# EAGLE design MesschieberV2 (EAGLE 6.4)

## Sheet 1 of 4
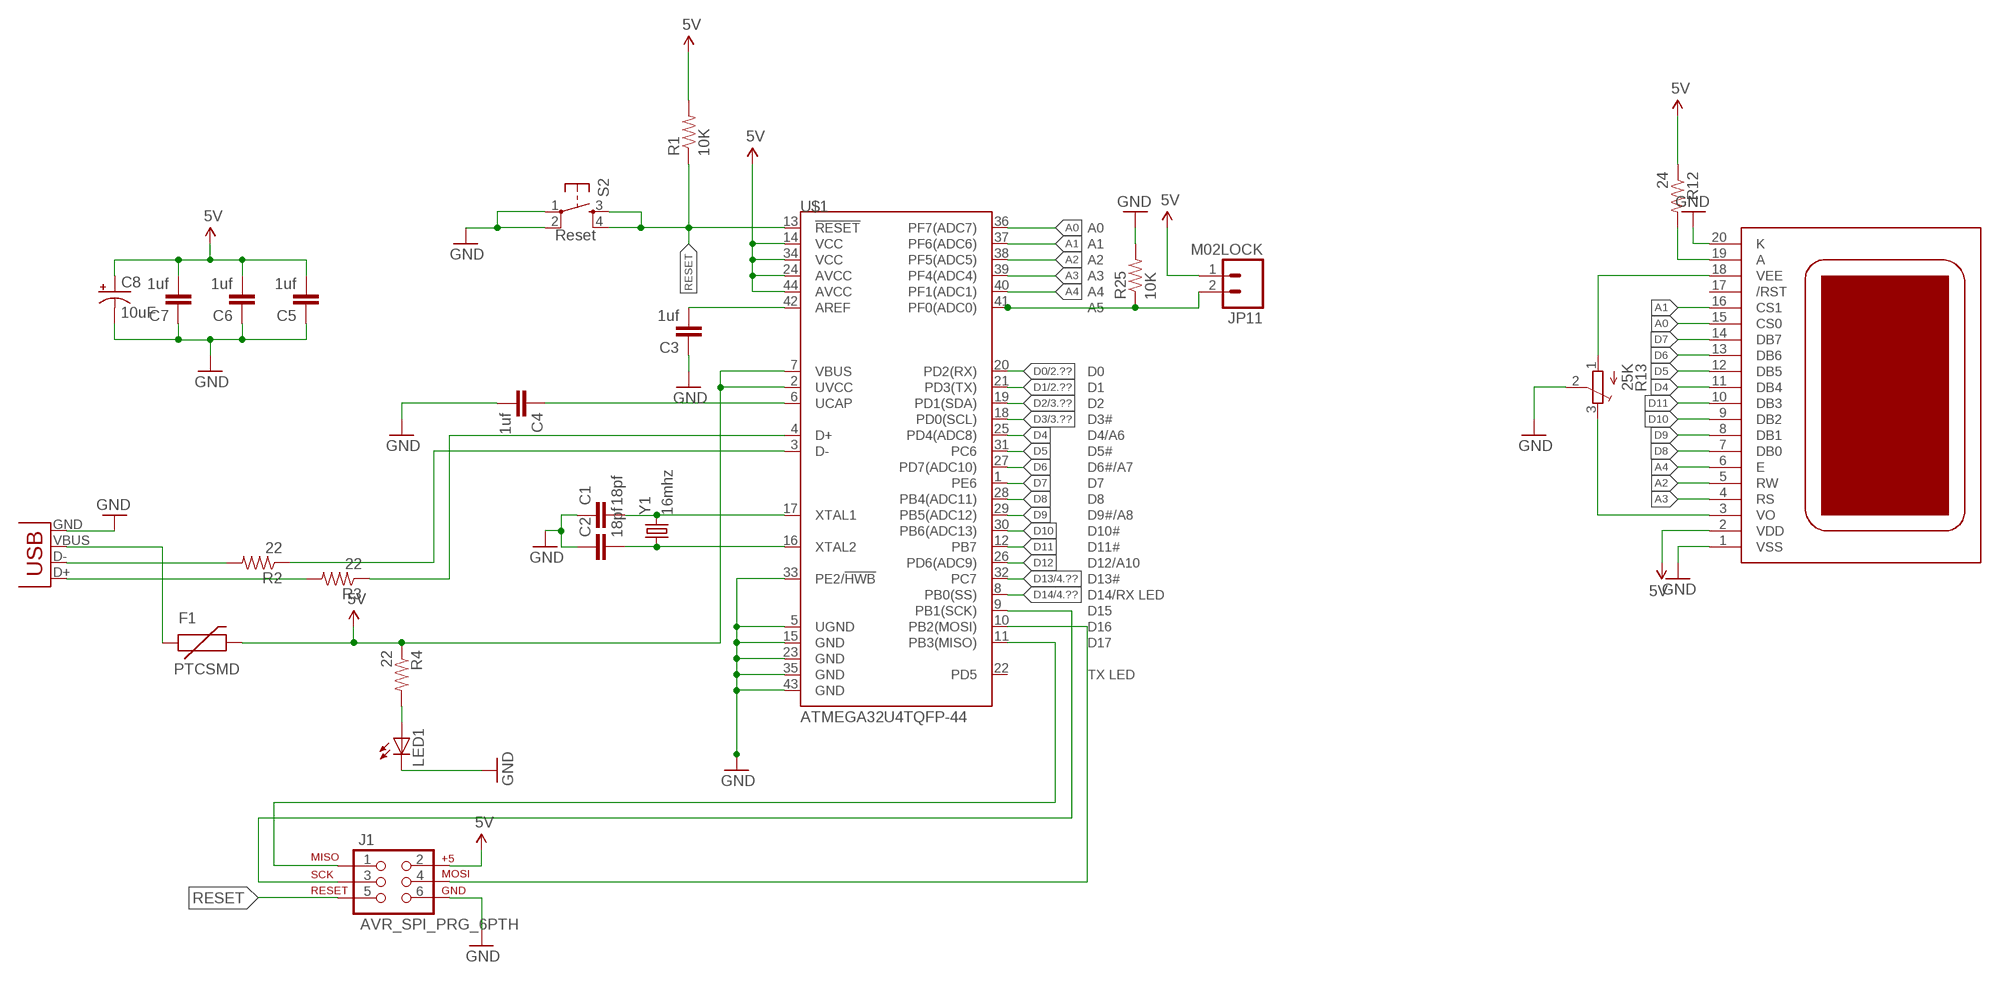
[diagram p0: schematic, sheet 1]

### Parts
C1  18pf  CAP0805  [0805]
C2  18pf  CAP0805  [0805]
C3  1uf  CAP0805  [0805]
C4  1uf  CAP0805  [0805]
C5  1uf  CAP0805  [0805]
C6  1uf  CAP0805  [0805]
C7  1uf  CAP0805  [0805]
C8  10uF  10UF-20V-10%(TANT)  [EIA3528]
F1  PTCSMD  [PTC-1206]
J1  AVR_SPI_PRG_6PTH  [2X3]
JP7  USB-SMD-NS  [USB-MINIB-NOSTOP]
JP11  M02LOCK  [1X02_LOCK]
LED1  LEDSML0805  [SML0805]
R1  10K  RESISTOR  [0805]
R2  22  RESISTOR  [0805]
R3  22  RESISTOR  [0805]
R4  22  RESISTOR  [0805]
R12  24  RESISTOR  [0805]
R13  25K  TRIM_EU-SM-42/43A  [SM-42/43A]
R25  10K  RESISTOR  [0805]
S2  Reset  TAC_SWITCHSND  [TACTILE_SWITCH_SMD]
U$1  ATMEGA32U4TQFP-44  [TQFP44]
U$2  TS12864A  [TS12864]
Y1  16mhz  CRYSTAL5X3  [CRYSTAL-SMD-5X3]

### Nets
5V: C5.2 C6.2 C7.2 C8.A(+) F1.2 J1.2 JP11.1 R1.2 R4.1 R12.1 U$1.2(UVCC) U$1.7(VBUS) U$1.14(VCC) U$1.24(AVCC) U$1.34(VCC) U$1.44(AVCC) U$2.2(VDD) ; also sheet 2,3,4
A: R12.2 U$2.19(A)
A0: U$1.36(PF7(ADC7)) U$2.15(CS0)
A1: U$1.37(PF6(ADC6)) U$2.16(CS1)
A2: U$1.38(PF5(ADC5)) U$2.5(RW)
A3: U$1.39(PF4(ADC4)) U$2.4(RS)
A4: U$1.40(PF1(ADC1)) U$2.6(E)
D0: U$1.20(PD2(RX)) ; also sheet 2
D1: U$1.21(PD3(TX)) ; also sheet 2
D2: U$1.19(PD1(SDA)) ; also sheet 3
D3: U$1.18(PD0(SCL)) ; also sheet 3
D4: U$1.25(PD4(ADC8)) U$2.11(DB4)
D5: U$1.31(PC6) U$2.12(DB5)
D6: U$1.27(PD7(ADC10)) U$2.13(DB6)
D7: U$1.1(PE6) U$2.14(DB7)
D8: U$1.28(PB4(ADC11)) U$2.7(DB0)
D9: U$1.29(PB5(ADC12)) U$2.8(DB1)
D10: U$1.30(PB6(ADC13)) U$2.9(DB2)
D11: U$1.12(PB7) U$2.10(DB3)
D12: U$1.26(PD6(ADC9))
D13: U$1.32(PC7) ; also sheet 4
D14: U$1.8(PB0(SS)) ; also sheet 4
GND: C1.1 C2.1 C3.1 C4.2 C5.1 C6.1 C7.1 C8.C(-) J1.6 JP7.GND LED1.C R13.2(S) R25.2 S2.1 S2.2 U$1.5(UGND) U$1.15(GND) U$1.23(GND) U$1.33(PE2/!HWB) U$1.35(GND) U$1.43(GND) U$2.1(VSS) U$2.20(K) ; also sheet 2,3,4
N$1: C3.2 U$1.42(AREF)
N$2: C2.2 U$1.16(XTAL2) Y1.1
N$3: C1.2 U$1.17(XTAL1) Y1.3
N$5: JP7.D- R2.2
N$6: JP7.D+ R3.2
N$7: R3.1 U$1.4(D+)
N$8: R2.1 U$1.3(D-)
N$9: F1.1 JP7.VBUS
N$10: LED1.A R4.2
N$11: J1.3 U$1.9(PB1(SCK))
N$12: J1.1 U$1.11(PB3(MISO))
N$13: J1.4 U$1.10(PB2(MOSI))
N$14: C4.1 U$1.6(UCAP)
N$29: JP11.2 R25.1 U$1.41(PF0(ADC0))
N$38: R13.3(E) U$2.3(VO)
RESET: J1.5 R1.1 S2.3 S2.4 U$1.13(!RESET)
VEE: R13.1(A) U$2.18(VEE)
Unconnected: U$1.22(PD5) U$2.17(/RST)

## Sheet 2 of 4
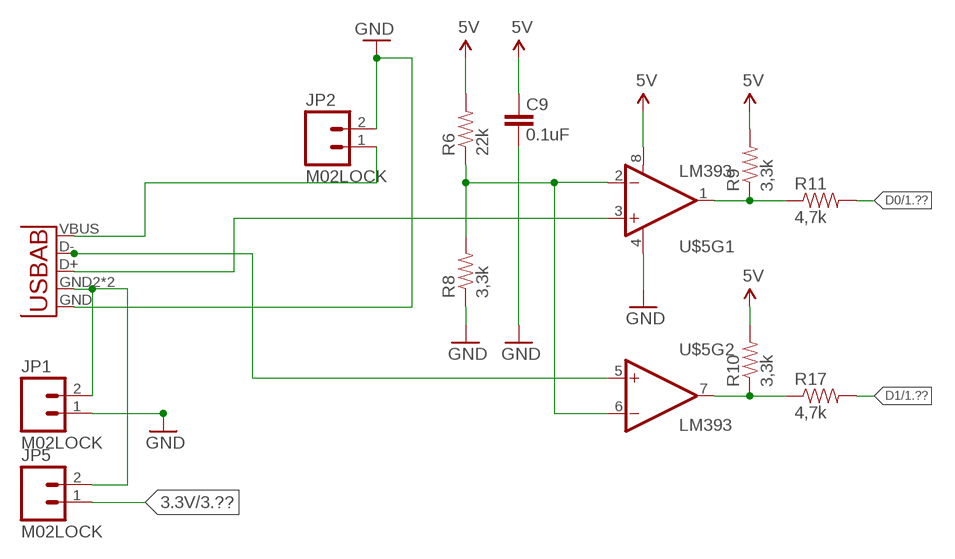
[diagram p1: schematic, sheet 2]

### Parts
C9  0.1uF  CAP0805  [0805]
JP1  M02LOCK  [1X02_LOCK]
JP2  M02LOCK  [1X02_LOCK]
JP5  M02LOCK  [1X02_LOCK]
R6  22k  RESISTOR  [0805]
R8  3,3k  RESISTOR  [0805]
R9  3,3k  RESISTOR  [0805]
R10  3,3k  RESISTOR  [0805]
R11  4,7k  RESISTOR  [0805]
R17  4,7k  RESISTOR  [0805]
U$5  LM393  [SO08]
U$7  USB-A  [USB-A]

### Nets
3.3V: JP5.1 ; also sheet 3,4
5V: C9.2 R6.2 R9.2 R10.2 U$5.8(V+) ; also sheet 1,3,4
D0: R11.2 ; also sheet 1
D1: R17.2 ; also sheet 1
DATA1: R9.1 R11.1 U$5.1(OUT)
GND: C9.1 JP1.1 JP2.2 R8.1 U$5.4(V-) U$7.GND ; also sheet 1,3,4
N$4: R6.1 R8.2 U$5.2(-IN) U$5.6(-IN)
N$16: U$5.3(+IN) U$7.D+
N$17: U$5.5(+IN) U$7.D-
N$18: JP2.1 U$7.VBUS
N$19: JP1.2 JP5.2 U$7.GND2(USBID) U$7.GND3(USBID)
SCK1: R10.1 R17.1 U$5.7(OUT)

## Sheet 3 of 4
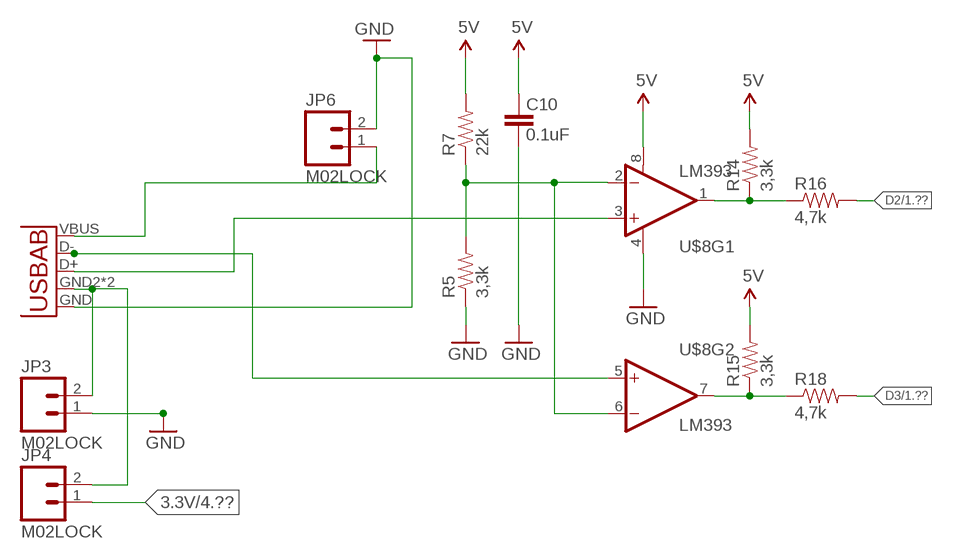
[diagram p2: schematic, sheet 3]

### Parts
C10  0.1uF  CAP0805  [0805]
JP3  M02LOCK  [1X02_LOCK]
JP4  M02LOCK  [1X02_LOCK]
JP6  M02LOCK  [1X02_LOCK]
R5  3,3k  RESISTOR  [0805]
R7  22k  RESISTOR  [0805]
R14  3,3k  RESISTOR  [0805]
R15  3,3k  RESISTOR  [0805]
R16  4,7k  RESISTOR  [0805]
R18  4,7k  RESISTOR  [0805]
U$8  LM393  [SO08]
U$9  USB-A  [USB-A]

### Nets
3.3V: JP4.1 ; also sheet 2,4
5V: C10.2 R7.2 R14.2 R15.2 U$8.8(V+) ; also sheet 1,2,4
D2: R16.2 ; also sheet 1
D3: R18.2 ; also sheet 1
DATA2: R14.1 R16.1 U$8.1(OUT)
GND: C10.1 JP3.1 JP6.2 R5.1 U$8.4(V-) U$9.GND ; also sheet 1,2,4
N$15: R5.2 R7.1 U$8.2(-IN) U$8.6(-IN)
N$20: U$8.3(+IN) U$9.D+
N$21: U$8.5(+IN) U$9.D-
N$22: JP6.1 U$9.VBUS
N$23: JP3.2 JP4.2 U$9.GND2(USBID) U$9.GND3(USBID)
SCK2: R15.1 R18.1 U$8.7(OUT)

## Sheet 4 of 4
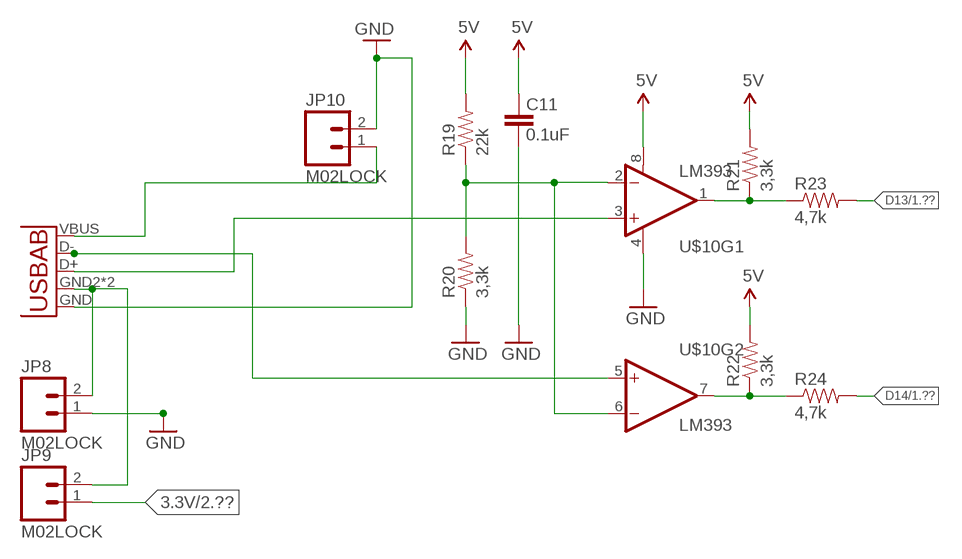
[diagram p3: schematic, sheet 4]

### Parts
C11  0.1uF  CAP0805  [0805]
JP8  M02LOCK  [1X02_LOCK]
JP9  M02LOCK  [1X02_LOCK]
JP10  M02LOCK  [1X02_LOCK]
R19  22k  RESISTOR  [0805]
R20  3,3k  RESISTOR  [0805]
R21  3,3k  RESISTOR  [0805]
R22  3,3k  RESISTOR  [0805]
R23  4,7k  RESISTOR  [0805]
R24  4,7k  RESISTOR  [0805]
U$10  LM393  [SO08]
U$11  USB-A  [USB-A]

### Nets
3.3V: JP9.1 ; also sheet 2,3
5V: C11.2 R19.2 R21.2 R22.2 U$10.8(V+) ; also sheet 1,2,3
D13: R23.2 ; also sheet 1
D14: R24.2 ; also sheet 1
DATA3: R21.1 R23.1 U$10.1(OUT)
GND: C11.1 JP8.1 JP10.2 R20.1 U$10.4(V-) U$11.GND ; also sheet 1,2,3
N$24: R19.1 R20.2 U$10.2(-IN) U$10.6(-IN)
N$25: U$10.3(+IN) U$11.D+
N$26: U$10.5(+IN) U$11.D-
N$27: JP10.1 U$11.VBUS
N$28: JP8.2 JP9.2 U$11.GND2(USBID) U$11.GND3(USBID)
SCK3: R22.1 R24.1 U$10.7(OUT)

## Library data of the parts
C1-C7 = SparkFun-Capacitors:CAP: Capacitor Standard 0603 ceramic capacitor, and 0.1" leaded capacitor.
C8 = SparkFun-Capacitors:10UF-20V-10%(TANT): CAP-08063; PROD_ID: CAP-08063
C9-C11 = SparkFun:CAP: Capacitor Standard 0603 ceramic capacitor, and 0.1" leaded capacitor.
F1 = SparkFun-PowerIC:PTC: Resettable Fuse PTC Resettable Fuse. Spark Fun Electronics SKU : COM-08357; PROD_ID: RES-11150
J1 = SparkFun-Connectors:AVR_SPI_PRG_6: AVR ISP 6 Pin This is the reduced ISP connector for AVR programming. Common on Arduino. This footprint will take up less PCB space and can be used with a 10-pin to 6-pin adapter such as SKU: BOB-08508
JP1-JP6 JP8-JP11 = SparkFun-Connectors:M02: Standard 2-pin 0.1" header. Use with - straight break away headers ( PRT-00116) - right angle break away headers (PRT-00553) - swiss pins (PRT-00743) - machine pins (PRT-00117) - female headers (PRT-00115) Molex polarized connector foot print use with: PRT-08233 with associated crimp pins and housings. 2.54_SCREWTERM for use with PRT-10571. 3.5mm Screw Terminal footprints for PRT-08084 5mm Screw Terminal footprints for use with PRT-08433
JP7 = SparkFun-Connectors:USB: USB Connectors USB-B-PTH is fully proven SKU : PRT-00139/CONN-08278 USB-miniB is fully proven SKU : PRT-00587 USB-A-PCB is untested. USB-A-H is throughly reviewed, but untested. Spark Fun Electronics SKU : PRT-00437 USB-B-SMT is throughly reviewed, but untested. Needs silkscreen touching up. USB-A-S has not been used/tested USB-MB-H has not been used/tested USB-MICROB has been used. CONN-09505
LED1 = led:LED: LED OSRAM: - CHIPLED LG R971, LG N971, LY N971, LG Q971, LY Q971, LO R971, LY R971 LH N974, LH R974 LS Q976, LO Q976, LY Q976 LO Q996 - Hyper CHIPLED LW Q18S LB Q993, LB Q99A, LB R99A - SideLED LS A670, LO A670, LY A670, LG A670, LP A670 LB A673, LV A673, LT A673, LW A673 LH A674 LY A675 LS A676, LA A676, LO A676, LY A676, LW A676 LS A679, LY A679, LG A679 - Hyper Micro SIDELED® LS Y876, LA Y876, LO Y876, LY Y876 LT Y87S - SmartLED LW L88C, LW L88S LB L89C, LB L89S, LG L890 LS L89K, LO L89K, LY L89K LS L896, LA L896, LO L896, LY L896 - TOPLED LS T670, LO T670, LY T670, LG T670, LP T670 LSG T670, LSP T670, LSY T670, LOP T670, LYG T670 LG T671, LOG T671, LSG T671 LB T673, LV T673, LT T673, LW T673 LH T674 LS T676, LA T676, LO T676, LY T676, LB T676, LH T676, LSB T676, LW T676 LB T67C, LV T67C, LT T67C, LS T67K, LO T67K, LY T67K, LW E67C LS E67B, LA E67B, LO E67B, LY E67B, LB E67C, LV E67C, LT E67C LW T67C LS T679, LY T679, LG T679 LS T770, LO T770, LY T770, LG T770, LP T770 LB T773, LV T773, LT T773, LW T773 LH T774 LS E675, LA E675, LY E675, LS T675 LS T776, LA T776, LO T776, LY T776, LB T776 LHGB T686 LT T68C, LB T68C - Hyper Mini TOPLED® LB M676 - Mini TOPLED Santana® LG M470 LS M47K, LO M47K, LY M47K Source: http://www.osram.convergy.de LUXEON: - LUMILED® LXK2-PW12-R00, LXK2-PW12-S00, LXK2-PW14-U00, LXK2-PW14-V00 LXK2-PM12-R00, LXK2-PM12-S00, LXK2-PM14-U00 LXK2-PE12-Q00, LXK2-PE12-R00, LXK2-PE12-S00, LXK2-PE14-T00, LXK2-PE14-U00 LXK2-PB12-K00, LXK2-PB12-L00, LXK2-PB12-M00, LXK2-PB14-N00, LXK2-PB14-P00, LXK2-PB14-Q00 LXK2-PR12-L00, LXK2-PR12-M00, LXK2-PR14-Q00, LXK2-PR14-R00 LXK2-PD12-Q00, LXK2-PD12-R00, LXK2-PD12-S00 LXK2-PH12-R00, LXK2-PH12-S00 LXK2-PL12-P00, LXK2-PL12-Q00, LXK2-PL12-R00 Source: www.luxeon.com KINGBRIGHT: KA-3528ASYC Source: www.kingbright.com
R1-R12 R14-R25 = SparkFun:RESISTOR: Resistor Basic schematic elements and footprints for 0603, 1206, and PTH 1/10th watt (small) resistors.
R13 = pot:TRIM_EU-: POTENTIOMETER
S2 = SparkFun:TAC_SWITCH: Momentary Switch Button commonly used for reset or general input. Spark Fun Electronics SKU : COM-00097
U$1 = SparkFun-DigitalIC:ATMEGA32U4: Atmel 44-pin 8-bit Microcontroller with 32KBytes of ISP Flash and USB Controller
U$2 = adafruit:TS12864A: KS0108 based display. Some have slightly different pinouts so double check!
U$5 U$8 U$10 = SparkFun-AnalogIC:LM393: Low-voltage comparator
U$7 U$9 U$11 = andi:USB-A
Y1 = SparkFun-FreqCtrl:CRYSTAL: Various standard crystals. Proven footprints. Spark Fun Electronics SKU : COM-00534

## Net classes
0 default: width 0.203 mm, clearance 0.205 mm
1 vcc: width 0.254 mm, clearance 0.205 mm to class 0, clearance 0.205 mm

## Board
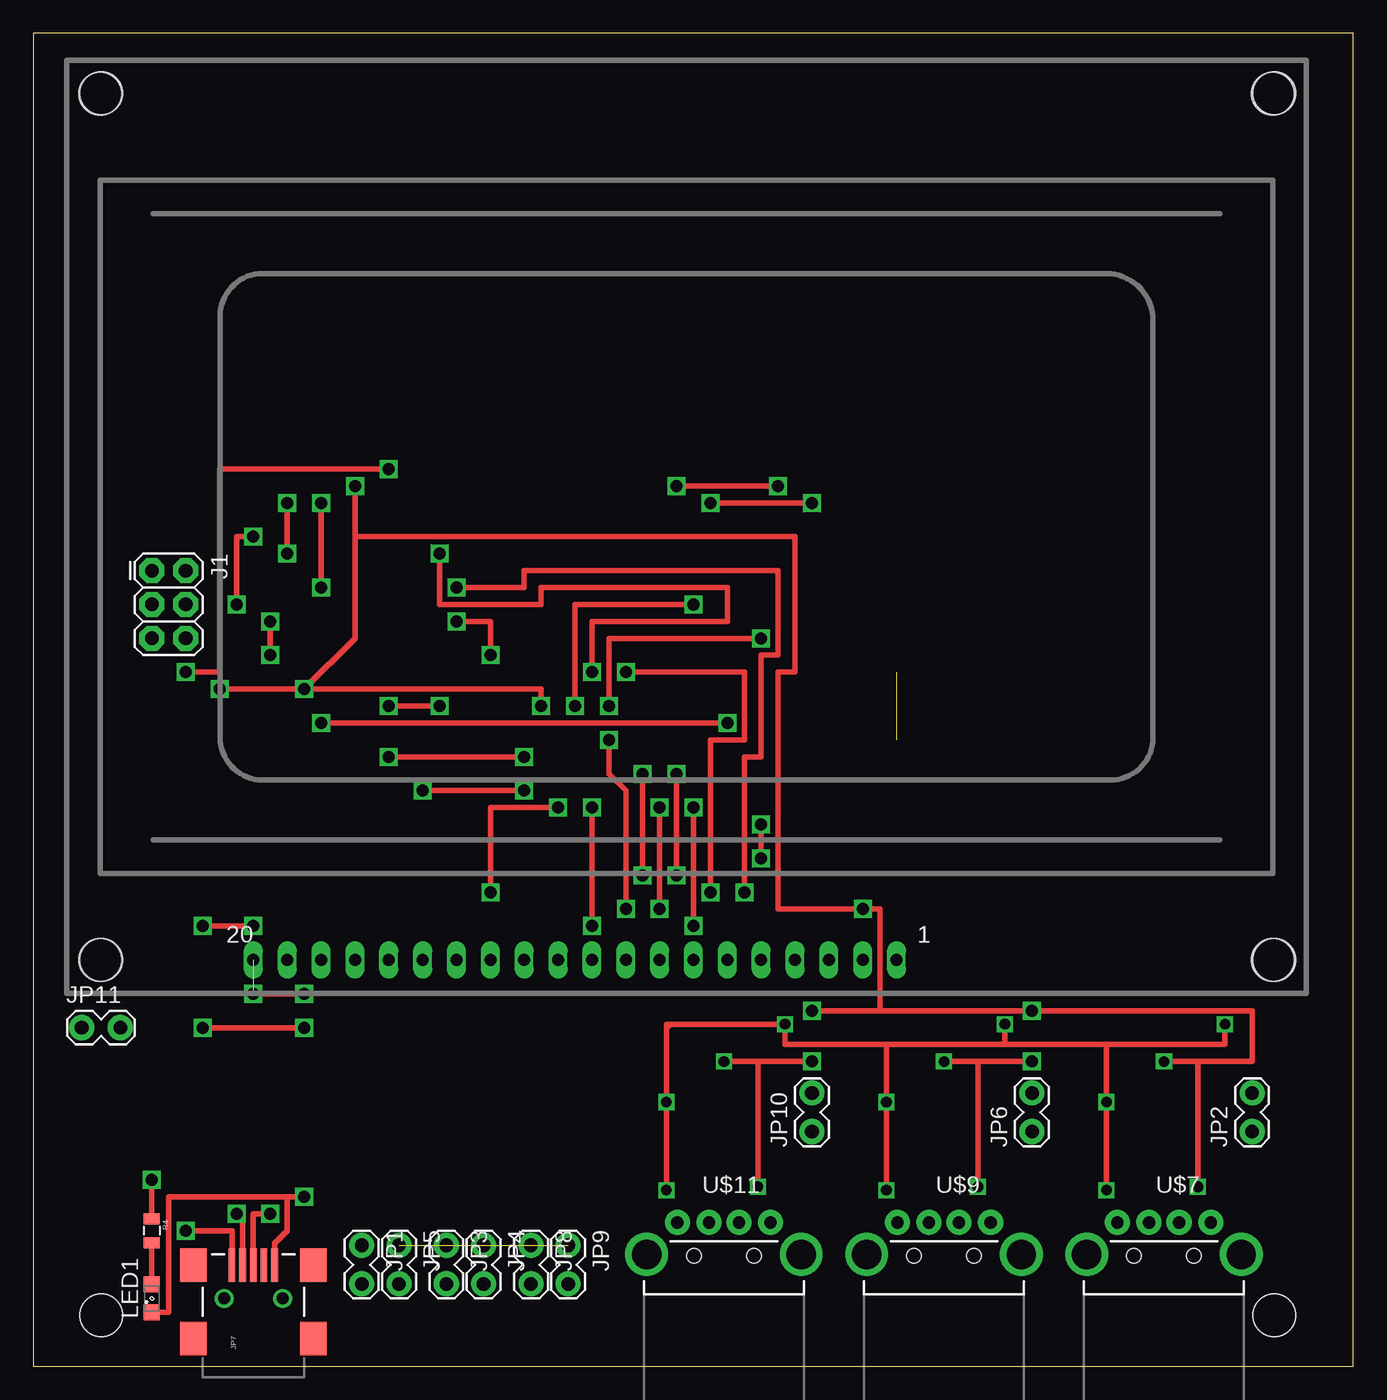
[diagram p4: board, top side]
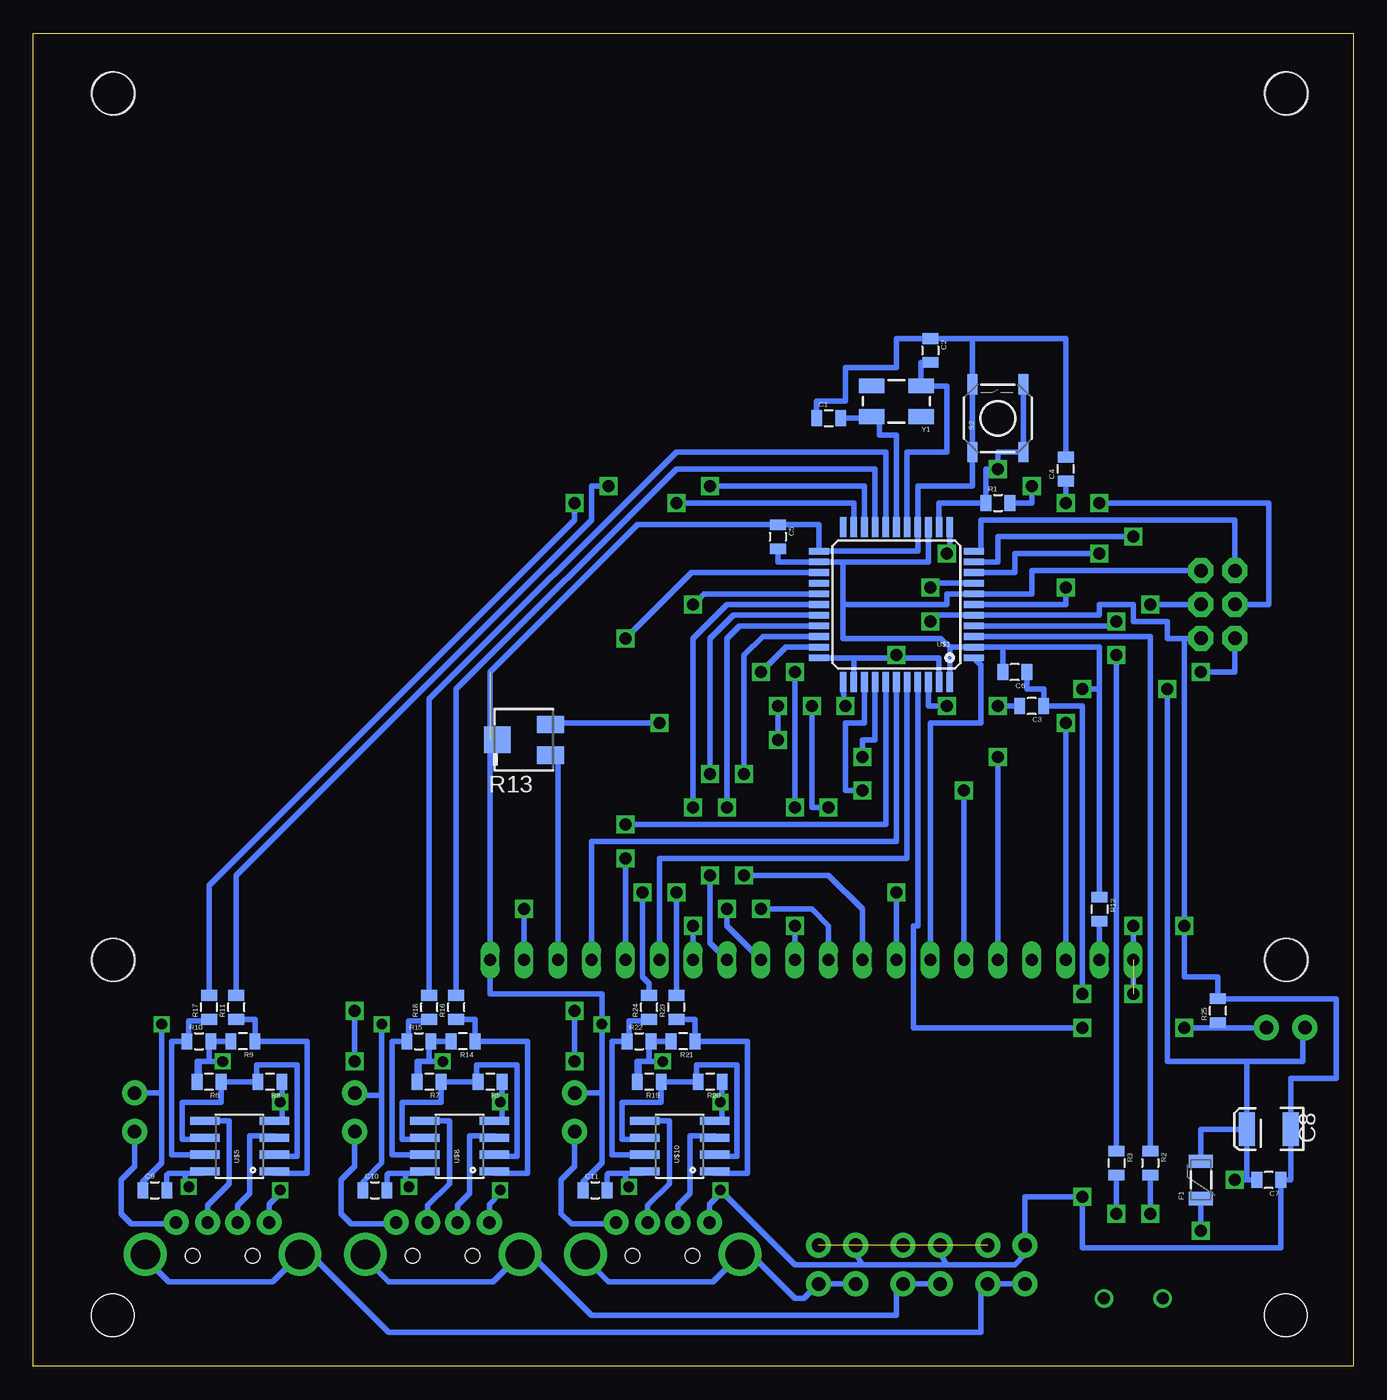
[diagram p5: board, bottom side, seen from below]

Size 99.04 x 100 mm. Coordinates in mm from the lower left corner, seen from the top.
Outline: 0,0 99.04,0 99.04,100 0,100 0,0
Copper layers (1*16): Top 0.035mm / dielectric 1.5mm / Bottom 0.035mm
Design rules "default": minimum track width 10mil, minimum drill 24mil, track to track 8mil, track to pad 8mil, pad to pad 8mil, via to via 8mil, smd to smd 8mil, copper to edge 40mil, drill to drill 8mil, minimum pad ring 10mil, minimum via ring 8mil, stop-mask expansion 4mil, vias tented up to drill 0mil, thermal gap 10mil
Holes 3.2 mm at 5.08,95.5 93.09,95.5 93.09,30.48 5.08,30.48 5.08,3.81 93.09,3.81

### Footprints (pad centres in the part's own frame; a part is rotated, then mirrored left to right if it is on the bottom)
0805 = smd 0.8 x 1.2: 1 -0.9,0; 2 0.9,0
EIA3528 = smd 1.2 x 2.5: A 1.65,0; C -1.65,0
PTC-1206 = smd 1 x 1.8: 1 -1.4,0; 2 1.4,0
2X3 = drill 1.016 pad 1.88 octagon: 1 0,0; 2 0,2.54; 3 2.54,0; 4 2.54,2.54; 5 5.08,0; 6 5.08,2.54
1X02_LOCK = drill 1.016 pad 1.88: 1 -0.178,0; 2 2.718,0
USB-MINIB-NOSTOP = smd 2.5 x 0.5: D+ 2.5,0; D- 2.5,0.8; GND 2.5,-1.6; ID 2.5,-0.8; VBUS 2.5,1.6 | smd 2.5 x 2: G1 -3,-4.5; G2 -3,4.5; G3 2.5,4.5; G4 2.5,-4.5 | drill 0.9 pad 0.8: H1 0,2.2 | drill 0.9 pad 0.787: H2 0,-2.2
SML0805 = smd 1.2 x 1.2: A 1.05,0; C -1.05,0
SM-42/43A = smd 2 x 1.3: 1 2,1.15; 3 2,-1.15 | smd 2 x 2: 2 -2,0
TACTILE_SWITCH_SMD = smd 1.524 x 0.762: 1 -2.54,1.905; 2 2.54,1.905; 3 -2.54,-1.905; 4 2.54,-1.905
TQFP44 = smd 1.5 x 0.5: 1 -5.8,4; 2 -5.8,3.2; 3 -5.8,2.4; 4 -5.8,1.6; 5 -5.8,0.8; 6 -5.8,0; 7 -5.8,-0.8; 8 -5.8,-1.6; 9 -5.8,-2.4; 10 -5.8,-3.2; 11 -5.8,-4; 23 5.8,-4; 24 5.8,-3.2; 25 5.8,-2.4; 26 5.8,-1.6; 27 5.8,-0.8; 28 5.8,0; 29 5.8,0.8; 30 5.8,1.6; 31 5.8,2.4; 32 5.8,3.2; 33 5.8,4 | smd 0.5 x 1.5: 12 -4,-5.8; 13 -3.2,-5.8; 14 -2.4,-5.8; 15 -1.6,-5.8; 16 -0.8,-5.8; 17 0,-5.8; 18 0.8,-5.8; 19 1.6,-5.8; 20 2.4,-5.8; 21 3.2,-5.8; 22 4,-5.8; 34 4,5.8; 35 3.2,5.8; 36 2.4,5.8; 37 1.6,5.8; 38 0.8,5.8; 39 0,5.8; 40 -0.8,5.8; 41 -1.6,5.8; 42 -2.4,5.8; 43 -3.2,5.8; 44 -4,5.8
TS12864 = drill 0.9 long: 1 48.26,0; 2 45.72,0; 3 43.18,0; 4 40.64,0; 5 38.1,0; 6 35.56,0; 7 33.02,0; 8 30.48,0; 9 27.94,0; 10 25.4,0; 11 22.86,0; 12 20.32,0; 13 17.78,0; 14 15.24,0; 15 12.7,0; 16 10.16,0; 17 7.62,0; 18 5.08,0; 19 2.54,0; 20 0,0 | hole 3.2: -11.5,65; 76.5,65; -11.5,0; 76.5,0
SO08 = smd 0.61 x 2.21: 1 -1.905,-2.616; 2 -0.635,-2.616; 3 0.635,-2.616; 4 1.905,-2.616; 5 1.905,2.616; 6 0.635,2.616; 7 -0.635,2.616; 8 -1.905,2.616
USB-A = drill 0.914 pad 1.88: D+ 10.02,1.127; D- 10.02,-1.127; GND 10.02,3.5; VBUS 10.02,-3.5 | drill 2.2: GND2 7.62,-5.8; GND3 7.62,5.8 | hole 1.1: 7.52,2.25; 7.52,-2.25
CRYSTAL-SMD-5X3 = smd 1.9 x 1.1: 1 -1.85,-1.15; 2 1.85,-1.15; 3 1.85,1.15; 4 -1.85,1.15

### Placement (x,y rotation side)
C1  39.37,71.12 0 bottom
C2  31.75,76.2 270 bottom
C3  24.13,49.53 180 bottom
C4  21.59,67.31 90 bottom
C5  43.18,62.23 270 bottom
C6  25.4,52.07 180 bottom
C7  6.35,13.97 180 bottom
C8  6.35,17.78 180 bottom
C9  89.92,13.21 0 bottom
C10  73.41,13.21 0 bottom
C11  56.9,13.21 0 bottom
F1  11.43,13.97 90 bottom
J1  8.89,59.69 270 top
JP1  24.64,8.89 270 top
JP2  91.44,17.78 90 top
JP3  30.99,8.89 270 top
JP4  33.78,8.89 270 top
JP5  27.43,8.89 270 top
JP6  74.93,17.78 90 top
JP7  16.51,5.08 90 top
JP8  37.34,8.89 270 top
JP9  40.13,8.89 270 top
JP10  58.42,17.78 90 top
JP11  3.81,25.4 0 top
LED1  8.89,5.08 90 top
R1  26.67,64.77 0 bottom
R2  15.24,15.24 270 bottom
R3  17.78,15.24 270 bottom
R4  8.89,10.16 270 top
R5  64.77,21.34 180 bottom
R6  85.85,21.34 180 bottom
R7  69.34,21.34 180 bottom
R8  81.28,21.34 180 bottom
R9  83.31,24.38 180 bottom
R10  86.61,24.38 0 bottom
R11  83.82,26.92 90 bottom
R12  19.05,34.29 270 bottom
R13  62.23,46.99 0 bottom
R14  66.8,24.38 180 bottom
R15  70.1,24.38 0 bottom
R16  67.31,26.92 90 bottom
R17  85.85,26.92 90 bottom
R18  69.34,26.92 90 bottom
R19  52.83,21.34 180 bottom
R20  48.26,21.34 180 bottom
R21  50.29,24.38 180 bottom
R22  53.59,24.38 0 bottom
R23  50.8,26.92 90 bottom
R24  52.83,26.92 90 bottom
R25  10.16,26.67 90 bottom
S2  26.67,71.12 90 bottom
U$1  34.29,57.15 180 bottom
U$2  16.51,30.48 0 top
U$5  83.57,16.51 90 bottom
U$7  84.84,0.76 90 top
U$8  67.06,16.51 90 bottom
U$9  68.33,0.76 90 top
U$10  50.55,16.51 90 bottom
U$11  51.82,0.76 90 top
Y1  34.29,72.39 180 bottom

### Tracks (layer width: path | path; a pad name or v marks a point on that pad's centre or on a via)
3.3V  (2 unrouted)
5V  (via drill 0.8, 0.9)
  Top 0.406: v84.84,22.86 87.38,22.86 | 87.38,22.86 v87.38,13.46 | v68.33,22.86 70.87,22.86 | 70.87,22.86 v70.87,13.46 | v51.82,22.86 54.36,22.86 | 54.36,22.86 v54.36,13.46 | R4.1 v8.89,13.97 | v20.32,50.8 v13.97,50.8 | v24.13,66.04 24.13,62.23 | 24.13,62.23 24.13,54.61 v20.32,50.8 | 24.13,62.23 57.15,62.23 57.15,52.07 55.88,52.07 55.88,34.29 v62.23,34.29 63.5,34.29 63.5,26.67 | 70.87,22.86 v74.93,22.86 | 63.5,26.67 v74.93,26.67 91.44,26.67 91.44,22.86 87.38,22.86 | 63.5,26.67 v58.42,26.67 | v58.42,22.86 54.36,22.86 | v38.1,49.53 38.1,50.8 v20.32,50.8
  Bottom 0.406: R9.2 R10.2 85.85,24.38 85.85,22.86 | 85.85,22.86 86.61,22.86 | 86.61,22.86 86.75,22.86 R6.2 86.61,21.34 86.61,22.86 | U$5.8 86.31,14.48 87.63,14.48 | 87.63,14.48 88.9,14.48 89.02,14.36 C9.2 | 85.85,22.86 v84.84,22.86 | v87.38,13.46 87.63,13.46 87.63,14.48 | R14.2 R15.2 69.34,24.38 69.34,22.86 | 69.34,22.86 70.1,22.86 | 70.1,22.86 70.24,22.86 R7.2 70.1,21.34 70.1,22.86 | U$8.8 69.8,14.48 71.12,14.48 | 71.12,14.48 72.39,14.48 72.51,14.36 C10.2 | 69.34,22.86 v68.33,22.86 | v70.87,13.46 71.12,13.46 71.12,14.48 | R21.2 R22.2 52.83,24.38 52.83,22.86 | 52.83,22.86 53.59,22.86 | 53.59,22.86 53.73,22.86 R19.2 53.59,21.34 53.59,22.86 | U$10.8 53.29,14.48 54.61,14.48 | 54.61,14.48 55.88,14.48 56,14.36 C11.2 | 52.83,22.86 v51.82,22.86 | v54.36,13.46 54.61,13.46 54.61,14.48 | U$1.2 30.29,53.95 | F1.2 11.43,17.78 C8.A | C7.2 8,13.97 | 8,13.97 C8.A | U$1.2 26.3,53.95 C6.2 | J1.2 24.13,59.69 24.13,57.95 U$1.7 30.48,57.95 30.48,57.15 38.29,57.15 | U$1.2 19.05,53.95 R12.1 19.05,50.8 v20.32,50.8 | 38.29,60.35 U$1.24 43.18,60.35 C5.2 | 38.29,60.35 38.29,57.15 | U$1.14 31.89,60.35 38.29,60.35 | U$1.44 30.29,53.95 | 38.29,57.15 38.29,54.61 30.95,54.61 30.29,53.95 | v8.89,13.97 8,13.97 | C8.A 8,22.86 | 8,22.86 3.81,22.86 3.81,25.4 JP11.1 | v13.97,50.8 13.97,22.86 8,22.86 | v58.42,26.67 v58.42,22.86 | v62.23,34.29 U$2.2 | v74.93,22.86 v74.93,26.67 | U$1.34 38.29,50.8 v38.1,49.53 | R1.2 24.13,64.77 v24.13,66.04
A
  Bottom 0.406: U$2.19 R12.2
A0  (via drill 0.9)
  Top 0.406: v36.83,43.18 v29.21,43.18
  Bottom 0.406: U$1.36 36.69,48.26 38.1,48.26 38.1,43.18 v36.83,43.18 | v29.21,43.18 U$2.15
A1  (via drill 0.9)
  Top 0.406: v36.83,45.72 v26.67,45.72
  Bottom 0.406: U$1.37 35.89,46.99 36.83,46.99 v36.83,45.72 | v26.67,45.72 U$2.16
A2  (via drill 0.9)
  Top 0.406: v54.61,40.64 v54.61,38.1
  Bottom 0.406: v54.61,40.64 35.09,40.64 U$1.38 | v54.61,38.1 U$2.5
A3
  Bottom 0.406: U$2.4 57.15,39.37 34.29,39.37 U$1.39
A4
  Bottom 0.406: U$2.6 52.07,38.1 33.49,38.1 U$1.40
D0  (via drill 0.9)
  Top 0.406: v48.26,66.04 v55.88,66.04
  Bottom 0.406: R11.2 83.82,36.83 57.15,63.5 57.15,66.04 v55.88,66.04 | U$1.20 36.69,66.04 v48.26,66.04
D1  (via drill 0.9)
  Top 0.406: v50.8,64.77 v58.42,64.77
  Bottom 0.406: R17.2 85.85,36.07 58.42,63.5 v58.42,64.77 | U$1.21 37.49,64.77 v50.8,64.77
D2
  Bottom 0.406: U$1.19 35.89,67.31 50.8,67.31 67.31,50.8 R16.2
D3
  Bottom 0.406: R18.2 69.34,50.04 50.8,68.58 35.09,68.58 U$1.18
D4  (via drill 0.9)
  Top 0.406: v54.61,54.61 43.18,54.61 v43.18,49.53 | v43.18,46.99 43.18,44.45 44.45,43.18 v44.45,34.29
  Bottom 0.406: U$1.25 49.67,59.55 v54.61,54.61 | v43.18,49.53 v43.18,46.99 | v44.45,34.29 40.64,34.29 39.37,33.02 U$2.11
D5  (via drill 0.9)
  Top 0.406: v45.72,44.45 v45.72,36.83
  Bottom 0.406: U$1.31 44.31,54.75 45.72,53.34 v45.72,44.45 | v45.72,36.83 39.37,36.83 36.83,34.29 U$2.12
D6  (via drill 0.9)
  Top 0.406: v34.29,35.56 34.29,41.91 v39.37,41.91 | v40.64,49.53 40.64,57.15 v49.53,57.15
  Bottom 0.406: U$2.13 v34.29,35.56 | v39.37,41.91 40.64,41.91 v40.64,49.53 | v49.53,57.15 48.73,57.95 U$1.27
D7
  Bottom 0.406: U$2.14 31.75,48.26 27.94,48.26 27.94,52.6 U$1.1
D8  (via drill 0.9)
  Top 0.406: v49.53,33.02 v49.53,41.91
  Bottom 0.406: U$2.7 v49.53,33.02 | v49.53,41.91 49.53,54.61 46.99,57.15 U$1.28
D9  (via drill 0.9)
  Top 0.406: v48.26,44.45 v48.26,36.83
  Bottom 0.406: U$1.29 46.52,56.35 48.26,54.61 v48.26,44.45 | v48.26,36.83 48.26,31.75 U$2.8
D10  (via drill 0.9)
  Top 0.406: v46.99,41.91 v46.99,34.29
  Bottom 0.406: U$1.30 46.05,55.55 46.99,54.61 v46.99,41.91 | v46.99,34.29 46.99,33.02 U$2.9
D11  (via drill 0.9)
  Top 0.406: v41.91,33.02 v41.91,41.91 | v41.91,52.07 41.91,55.88 52.07,55.88 52.07,58.42 38.1,58.42 38.1,57.15 30.48,57.15 v30.48,60.96
  Bottom 0.406: U$2.10 v41.91,33.02 | v41.91,41.91 v41.91,52.07 | U$1.12 30.29,60.96 v30.48,60.96
D13  (via drill 0.9)
  Top 0.406: v50.8,35.56 50.8,46.99 53.34,46.99 53.34,52.07 v44.45,52.07
  Bottom 0.406: R23.2 v50.8,35.56 | U$1.32 42.57,53.95 v44.45,52.07
D14  (via drill 0.9)
  Top 0.406: v53.34,35.56 53.34,45.72 54.61,45.72 54.61,53.34 55.88,53.34 55.88,59.69 36.83,59.69 36.83,58.42 v31.75,58.42
  Bottom 0.406: R24.2 52.83,28.7 53.34,29.21 v53.34,35.56 | U$1.8 31.75,58.75 v31.75,58.42
DATA1
  Bottom 0.406: U$5.1 80.95,14.48 78.49,14.48 78.49,24.38 R9.1 82.41,26.02 R11.1
DATA2
  Bottom 0.406: U$8.1 64.44,14.48 61.98,14.48 61.98,24.38 R14.1 65.9,26.02 R16.1
DATA3
  Bottom 0.406: U$10.1 47.93,14.48 45.47,14.48 45.47,24.38 R21.1 49.39,26.02 R23.1
GND  (via drill 0.8, 0.9)  (2 unrouted)
  Top 0.406: v80.52,13.21 v80.52,19.81 80.52,24.13 | v64.01,13.21 v64.01,19.81 64.01,24.13 | v47.5,13.21 v47.5,19.81 47.5,25.4 | 47.5,25.4 47.5,25.65 v56.39,25.65 56.39,24.13 64.01,24.13 | 47.75,25.65 47.5,25.4 | LED1.C 10.16,4.03 10.16,12.7 19.05,12.7 | JP7.GND 18.11,9.22 19.05,10.16 19.05,12.7 | v20.32,12.7 19.05,12.7 | v31.75,55.88 34.29,55.88 v34.29,53.34 | v16.51,33.02 v12.7,33.02 | v16.51,27.94 v20.32,27.94 | 72.9,24.13 64.01,24.13 | 80.52,24.13 89.41,24.13 v89.41,25.65 | v72.9,25.65 72.9,24.13 | 72.9,24.13 80.52,24.13
  Bottom 0.406: R8.1 80.38,19.81 | U$5.4 80.38,18.41 80.38,19.81 | C9.1 90.82,13.83 89.41,15.24 v89.41,25.65 89.41,20.5 JP2.2 | 80.38,19.81 v80.52,19.81 | v80.52,13.21 80.52,12.95 81.34,12.14 U$7.GND | R5.1 63.87,19.81 | U$8.4 63.87,18.41 63.87,19.81 | C10.1 74.31,13.83 72.9,15.24 72.9,20.32 | 63.87,19.81 v64.01,19.81 | v64.01,13.21 64.01,12.95 64.83,12.14 U$9.GND | R20.1 47.36,19.81 | U$10.4 47.36,18.41 47.36,19.81 | C11.1 57.8,13.83 56.39,15.24 56.39,20.5 | 47.36,19.81 v47.5,19.81 | U$11.GND 48.32,12.14 47.5,12.95 v47.5,13.21 41.91,7.62 36.83,7.62 | 30.48,7.62 25.4,7.62 24.64,8.38 JP1.1 24.64,12.7 v20.32,12.7 20.32,8.89 5.45,8.89 C7.1 4.7,13.97 C8.C 4.7,21.59 1.27,21.59 1.27,27.57 R25.2 10.16,29.21 12.7,29.21 v12.7,33.02 12.7,54.61 J1.6 13.97,54.61 13.97,55.88 16.51,55.88 16.51,57.15 19.05,57.15 19.05,56.35 U$1.5 31.75,56.35 v31.75,55.88 | JP3.1 30.99,8.38 30.48,7.62 | JP8.1 37.34,8.38 36.83,7.62 | 36.83,7.62 30.48,7.62 | R13.2 64.77,46.99 | C1.1 40.27,72.39 38.1,72.39 38.1,74.93 34.29,74.93 34.29,77.1 C2.1 28.57,77.1 | C6.1 24.5,50.8 23.23,50.8 C3.1 20.32,49.53 v20.32,27.94 | U$1.43 31.09,53.15 34.29,53.15 | 34.29,53.15 37.49,53.15 | 37.49,53.15 U$1.33 | U$1.35 37.49,53.15 | v34.29,53.34 34.29,53.15 | 28.57,77.1 S2.2 S2.1 28.57,66.04 32.69,66.04 U$1.15 32.69,61.15 U$1.23 40.09,63.13 C5.1 53.71,63.13 64.77,52.07 U$2.1 64.77,27.94 56.39,27.94 v56.39,25.65 56.39,20.5 | JP10.2 56.39,20.5 | 72.9,20.32 v72.9,25.65 | JP6.2 74.93,20.32 72.9,20.32 | C4.2 21.59,77.1 28.57,77.1 | v16.51,33.02 v16.51,27.94
N$1  (via drill 0.9)
  Top 0.406: v30.48,49.53 v26.67,49.53
  Bottom 0.406: U$1.42 31.89,49.53 v30.48,49.53 | v26.67,49.53 C3.2
N$2
  Bottom 0.406: U$1.16 33.49,68.58 30.48,68.58 30.48,73.54 Y1.1 32.44,75.3 C2.2
N$3
  Bottom 0.406: U$1.17 34.29,69.85 35.56,69.85 35.56,71.24 Y1.3 36.14,71.12 C1.2
N$4
  Bottom 0.406: U$5.6 86.18,17.02 87.88,17.02 87.88,19.81 84.95,19.81 R6.1 R8.2 82.3,21.34 82.3,22.61 79.25,22.61 79.25,15.75 80.95,15.75 U$5.2
N$5  (via drill 0.9)
  Top 0.406: JP7.D- 15.71,11.43 v15.24,11.43
  Bottom 0.406: v15.24,11.43 R2.2
N$6  (via drill 0.9)
  Top 0.406: JP7.D+ 16.51,11.43 v17.78,11.43
  Bottom 0.406: v17.78,11.43 R3.2
N$7  (via drill 0.9)
  Top 0.406: v17.78,53.34 v17.78,55.88
  Bottom 0.406: R3.1 v17.78,53.34 | U$1.4 17.78,55.55 v17.78,55.88
N$8
  Bottom 0.406: R2.1 15.24,54.75 U$1.3
N$9  (via drill 0.9)
  Top 0.406: JP7.VBUS 14.91,10.16 v11.43,10.16
  Bottom 0.406: v11.43,10.16 F1.1
N$10
  Top 0.406: LED1.A R4.2
N$11  (via drill 0.9)
  Top 0.406: v19.05,60.96 v19.05,64.77
  Bottom 0.406: J1.3 6.35,57.15 6.35,64.77 v19.05,64.77 | U$1.9 25.4,59.55 25.4,60.96 v19.05,60.96
N$12
  Bottom 0.406: U$1.11 27.94,61.15 27.94,63.5 8.89,63.5 J1.1
N$13  (via drill 0.9)
  Top 0.406: v16.51,62.23 15.24,62.23 v15.24,57.15
  Bottom 0.406: v15.24,57.15 J1.4 | v16.51,62.23 26.67,62.23 26.67,60.35 U$1.10
N$14  (via drill 0.9)
  Top 0.406: v21.59,58.42 v21.59,64.77
  Bottom 0.406: U$1.6 21.59,57.15 v21.59,58.42 | v21.59,64.77 C4.1
N$15
  Bottom 0.406: U$8.6 69.67,17.02 71.37,17.02 71.37,19.81 68.44,19.81 R7.1 R5.2 65.79,21.34 65.79,22.61 62.74,22.61 62.74,15.75 64.44,15.75 U$8.2
N$16
  Bottom 0.406: U$5.3 80.95,17.27 82.8,17.27 82.8,12.96 83.71,12.05 U$7.D+
N$17
  Bottom 0.406: U$5.5 84.33,18.41 84.33,13.69 85.96,12.05 U$7.D-
N$18
  Bottom 0.406: U$7.VBUS 88.45,10.67 91.69,10.67 92.46,11.43 92.46,13.97 91.44,14.99 JP2.1
N$19
  Bottom 0.406: U$7.GND2 90.64,8.09 88.9,6.35 81.07,6.35 U$7.GND3 78.23,8.38 72.39,2.54 27.94,2.54 27.94,5.66 JP5.2 JP1.2
N$20
  Bottom 0.406: U$8.3 64.44,17.27 66.29,17.27 66.29,12.96 67.2,12.05 U$9.D+
N$21
  Bottom 0.406: U$8.5 67.82,18.41 67.82,13.69 69.45,12.05 U$9.D-
N$22
  Bottom 0.406: U$9.VBUS 71.94,10.67 75.18,10.67 75.95,11.43 75.95,13.97 74.93,14.99 JP6.1
N$23
  Bottom 0.406: U$9.GND2 74.13,8.09 72.39,6.35 64.56,6.35 U$9.GND3 61.72,8.38 57.15,3.81 34.29,3.81 34.29,5.66 JP4.2 JP3.2
N$24
  Bottom 0.406: U$10.6 53.16,17.02 54.86,17.02 54.86,19.81 51.93,19.81 R19.1 R20.2 49.28,21.34 49.28,22.61 46.23,22.61 46.23,15.75 47.93,15.75 U$10.2
N$25
  Bottom 0.406: U$10.3 47.93,17.27 49.78,17.27 49.78,12.96 50.69,12.05 U$11.D+
N$26
  Bottom 0.406: U$10.5 51.31,18.41 51.31,13.69 52.94,12.05 U$11.D-
N$27
  Bottom 0.406: U$11.VBUS 55.43,10.67 58.67,10.67 59.44,11.43 59.44,13.97 58.42,14.99 JP10.1
N$28
  Bottom 0.406: U$11.GND2 57.62,8.09 55.88,6.35 48.05,6.35 U$11.GND3 45.21,8.38 41.91,5.08 41.22,5.08 JP9.2 JP8.2
N$29  (via drill 0.9)
  Top 0.406: v12.7,25.4 v20.32,25.4
  Bottom 0.406: U$1.41 32.69,33.02 33.02,33.02 33.02,25.4 v20.32,25.4 | JP11.2 10.16,25.4 | 10.16,25.4 v12.7,25.4 | R25.1 10.16,25.4
N$38
  Bottom 0.406: R13.3 59.69,45.84 U$2.3
RESET  (via drill 0.9)
  Top 0.406: v11.43,52.07 13.97,52.07 13.97,67.31 v26.67,67.31
  Bottom 0.406: S2.4 S2.3 26.67,68.58 v26.67,67.31 27.57,67.31 R1.1 31.09,64.77 U$1.13 | J1.5 8.89,52.07 v11.43,52.07
SCK1
  Bottom 0.406: R17.1 85.85,25.91 87.38,25.91 87.38,24.38 R10.1 88.65,24.38 88.65,15.88 U$5.7
SCK2
  Bottom 0.406: R18.1 69.34,25.91 70.87,25.91 70.87,24.38 R15.1 72.14,24.38 72.14,15.88 U$8.7
SCK3
  Bottom 0.406: R24.1 52.83,25.91 54.36,25.91 54.36,24.38 R22.1 55.63,24.38 55.63,15.88 U$10.7
VEE  (via drill 0.9)
  Top 0.406: v21.59,48.26 v52.07,48.26
  Bottom 0.406: U$2.18 v21.59,48.26 | v52.07,48.26 60.23,48.26 R13.1